# EAGLE schematic Jack Mount (EAGLE 9.6.2)
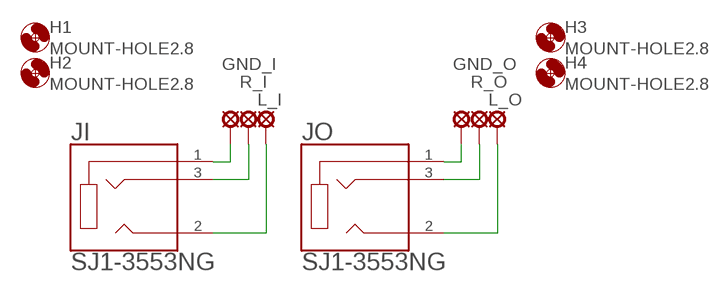
[diagram p0: schematic, sheet 1]

## Parts
GND_I  LSP10  [LSP10]
GND_O  LSP10  [LSP10]
H1  MOUNT-HOLE2.8  [2,8]
H2  MOUNT-HOLE2.8  [2,8]
H3  MOUNT-HOLE2.8  [2,8]
H4  MOUNT-HOLE2.8  [2,8]
JI  SJ1-3553NG  [CUI_SJ1-3553NG]
JO  SJ1-3553NG  [CUI_SJ1-3553NG]
L_I  LSP10  [LSP10]
L_O  LSP10  [LSP10]
R_I  LSP10  [LSP10]
R_O  LSP10  [LSP10]

## Nets
N$1: GND_I.MP JI.1
N$2: JI.3 R_I.MP
N$3: JI.2 L_I.MP
N$4: GND_O.MP JO.1
N$5: JO.3 R_O.MP
N$6: JO.2 L_O.MP

## Library data of the parts
GND_I GND_O L_I L_O R_I R_O = solpad:LSP10: SOLDER PAD drill 1.0 mm, distributor Buerklin, 12H555
H1-H4 = holes:MOUNT-HOLE: MOUNTING HOLE with drill center marker
JI JO = SJ1-3553NG:SJ1-3553NG: SJ1 Series 3.5 mm 12 V Right Angle Through Hole Isolated Stereo Audio Jack Check availability <https://pricing.snapeda.com/parts/SJ1-3553NG/CUI%20Devices/view-part?ref=eda>; AVAILABILITY: In Stock; CUI_PURCHASE_URL: https://www.cuidevices.com/product/interconnect/connectors/audio-connectors/jacks/sj1-355xng-series?utm_source=snapeda.com&utm_medium=referral&utm_campaign=snapedaBOM; DESCRIPTION: 3.5 mm, Stereo, Right Angle, Through Hole, Isolated Ground, Kinked Pins, Audio Jack Connector; MF: CUI Devices; MP: SJ1-3553NG; PACKAGE: None; PRICE: None; PURCHASE-URL: https://pricing.snapeda.com/search/part/SJ1-3553NG/?ref=eda